# EAGLE schematic PowerSupply (EAGLE 6.5.0)
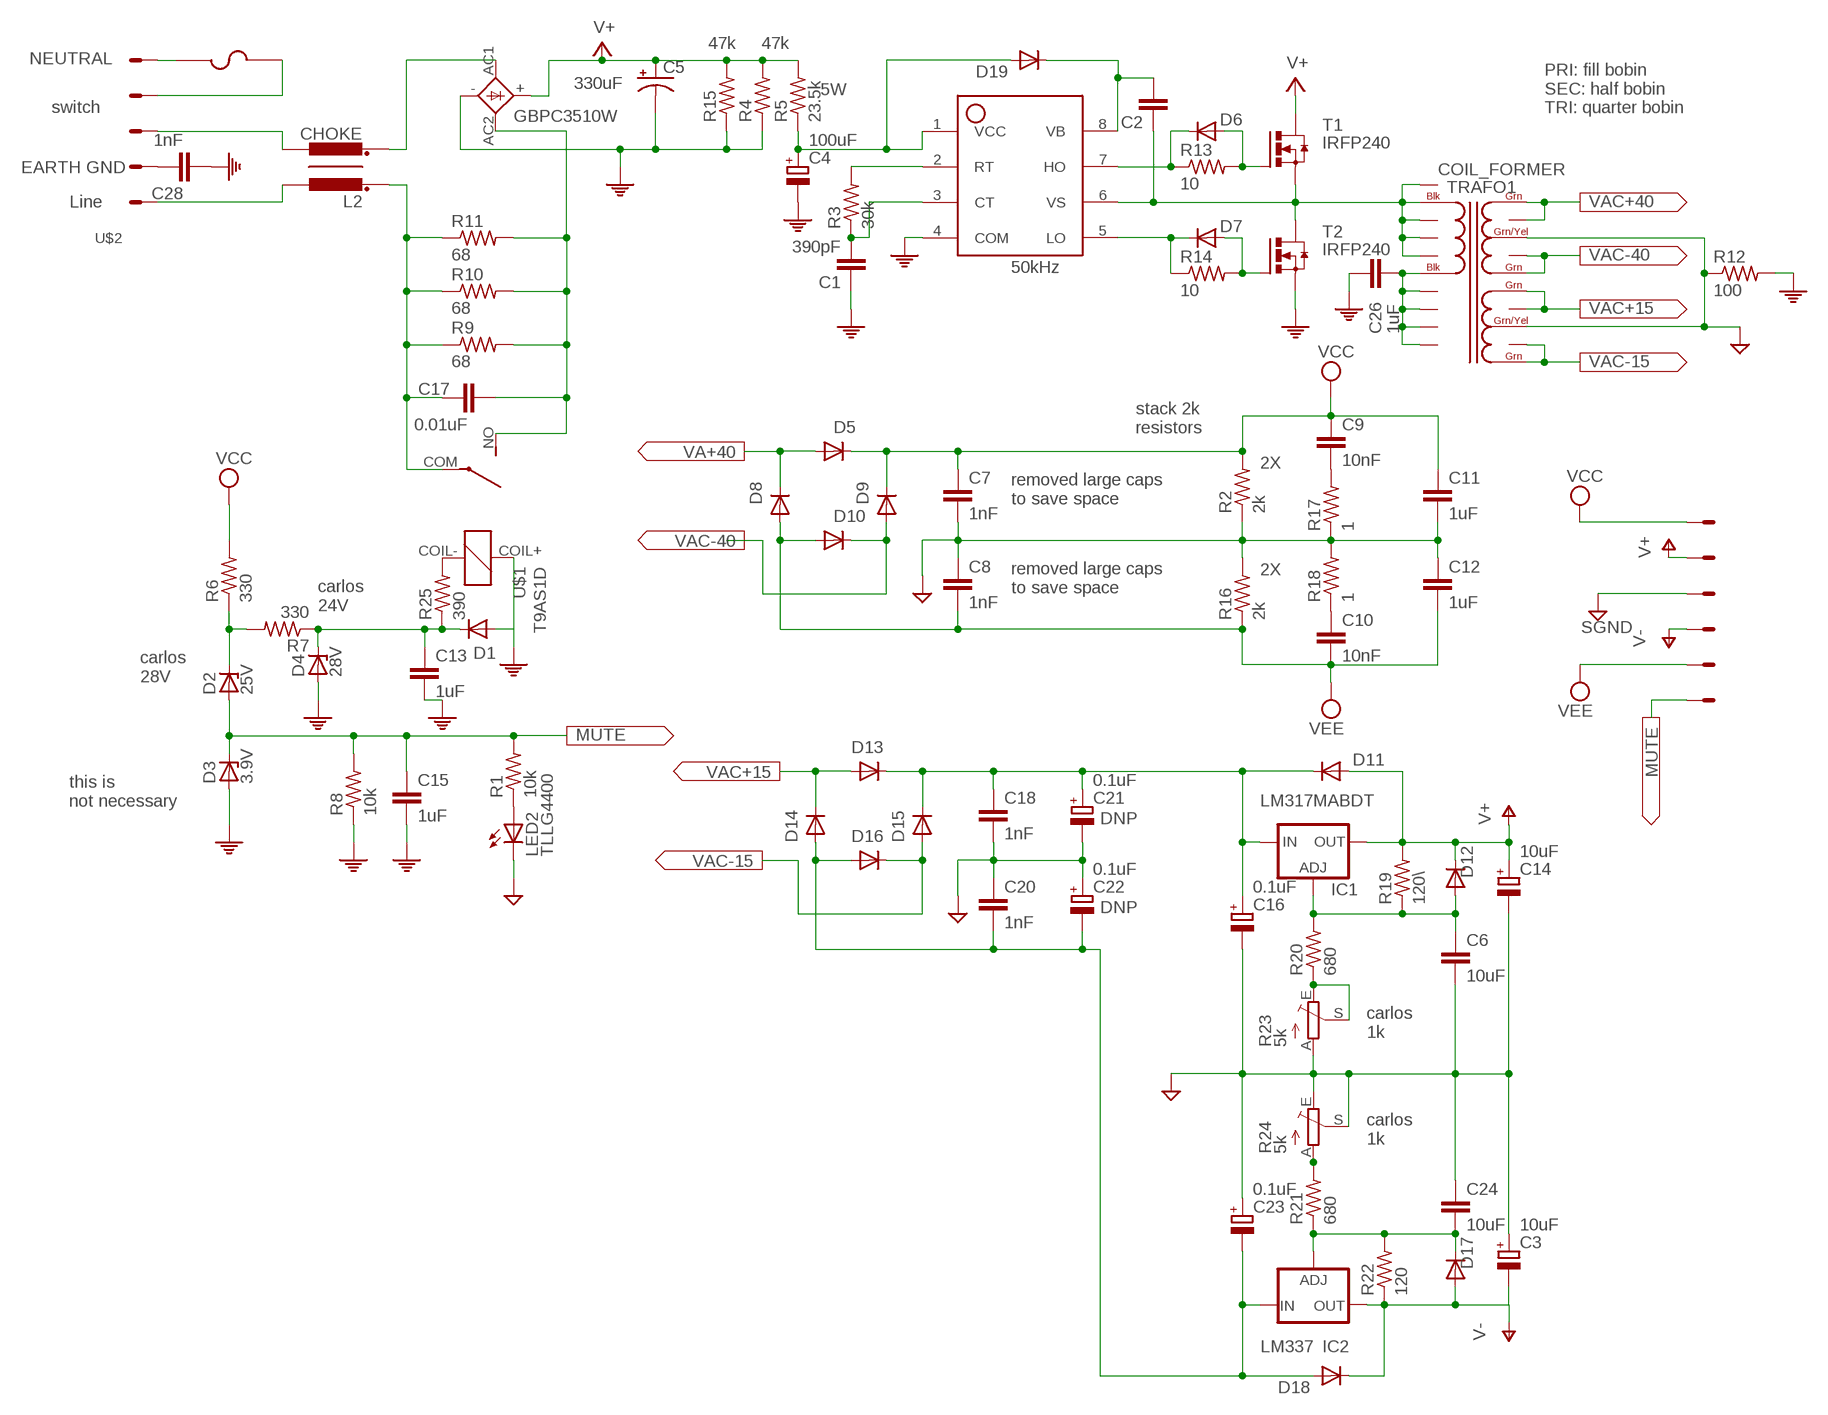
[diagram p0: schematic, sheet 1]

## Parts
C1  390pF  C-EU025-025X050  [C025-025X050]
C2  C-EU050-035X075  [C050-035X075]
C3  10uF  CPOL-EUE2.5-6  [E2,5-6]
C4  100uF  CPOL-EUE2.5-6  [E2,5-6]
C5  330uF  CPOL-USE7.5-18  [E7,5-18]
C6  10uF  C-EU025-025X050  [C025-025X050]
C7  1nF  C-EU102-064X133  [C102-064X133]
C8  1nF  C-EU102-064X133  [C102-064X133]
C9  10nF  C-EU102-064X133  [C102-064X133]
C10  10nF  C-EU102-064X133  [C102-064X133]
C11  1uF  C-EU102-064X133  [C102-064X133]
C12  1uF  C-EU102-064X133  [C102-064X133]
C13  1uF  C-EU102-064X133  [C102-064X133]
C14  10uF  CPOL-EUE2.5-6  [E2,5-6]
C15  1uF  C-EU102-064X133  [C102-064X133]
C16  0.1uF  CPOL-EUE2.5-6  [E2,5-6]
C17  0.01uF  C-EU075-042X103  [C075-042X103]
C18  1nF  C-EU102-064X133  [C102-064X133]
C20  1nF  C-EU102-064X133  [C102-064X133]
C21  0.1uF  CPOL-EUE2.5-6  [E2,5-6]
C22  0.1uF  CPOL-EUE2.5-6  [E2,5-6]
C23  0.1uF  CPOL-EUE2.5-6  [E2,5-6]
C24  10uF  C-EU025-025X050  [C025-025X050]
C26  1uF  C-EU025-025X050  [C025-025X050]
C28  1nF  C-EUC0805K  [C0805K]
D1  1N4004  [1N4004]
D2  25V  ZENER-DIODEP1-Z12  [P1Z12]
D3  3.9V  ZENER-DIODEZD-2.5  [ZDIO-2.5]
D4  28V  ZENER-DIODEP1-Z12  [P1Z12]
D5  VS-ETL1506-M3  [VS-ETL1506-M3]
D6  1N4004  [1N4004]
D7  1N4004  [1N4004]
D8  VS-ETL1506-M3  [VS-ETL1506-M3]
D9  VS-ETL1506-M3  [VS-ETL1506-M3]
D10  VS-ETL1506-M3  [VS-ETL1506-M3]
D11  1N4004  [1N4004]
D12  1N4004  [1N4004]
D13  1N4004  [1N4004]
D14  1N4004  [1N4004]
D15  1N4004  [1N4004]
D16  1N4004  [1N4004]
D17  1N4004  [1N4004]
D18  1N4004  [1N4004]
D19  1N4004  [1N4004]
IC1  LM317MABDT  [DPACK]
IC2  LM337  [LM337]
L2  CHOKE  [CHOKE]
LED2  TLLG4400  [LED3MM]
R1  10k  R-US_0204/2V  [0204V]
R2  2k  R-US_VTA52  [VTA52]
R3  30k  R-US_0204/2V  [0204V]
R4  47k  R-US_0617/5V  [0617V]
R5  23.5k  R-US_0617/5V  [0617V]
R6  330  R-US_0309/V  [0309V]
R7  330  R-US_0309/V  [0309V]
R8  10k  R-US_0204/2V  [0204V]
R9  68  R-US_0617/5V  [0617V]
R10  68  R-US_0617/5V  [0617V]
R11  68  R-US_0617/5V  [0617V]
R12  100  R-US_0207/15  [0207/15]
R13  10  R-US_0204/2V  [0204V]
R14  10  R-US_0204/2V  [0204V]
R15  47k  R-US_0617/5V  [0617V]
R16  2k  R-US_VTA52  [VTA52]
R17  1  R-US_0411/12  [0411/12]
R18  1  R-US_0411/12  [0411/12]
R19  120\  R-US_0204/2V  [0204V]
R20  680  R-US_0204/2V  [0204V]
R21  680  R-US_0204/2V  [0204V]
R22  120  R-US_0204/2V  [0204V]
R23  5k  TRIM_EU-B25P  [B25P]
R24  5k  TRIM_EU-B25P  [B25P]
R25  390  R-US_0204/2V  [0204V]
T1  IRFP240  [IRFP240]
T2  IRFP240  [IRFP240]
TRAFO1  COIL_FORMER  [COIL_FORMER]
U$1  T9AS1D  [RELAY_CM]
U$2  SCREW_TERMINAL_5  [SCREW_TERMINAL_5]
U$3  SCREW_TERMINAL_6  [SCREW_TERMINAL_6]
U$4  FUSE  [FUSE_PADS]
U$5  IRS2153D  [IRS2153D]
U$6  GBPC3510W  [GBPC3510W]

## Nets
EGND: C28.1 U$2.P$3(S2)
GND: C1.1 C4.- C5.- C13.2 C15.2 C26.1 C28.2 D1.A D3.A D4.A R4.1 R8.1 R12.2 R15.1 T2.S U$1.COIL+ U$5.4(COM) U$6.- ; supply symbol labelled PE
LINE: L2.PASS12 U$2.P$2(S1)
MUTE: C15.1 D2.A D3.C R1.2 R8.2 U$3.P$6(S6)
N$1: LED2.A R1.1
N$3: C24.2 D17.C IC2.1(ADJ) R21.1 R22.2
N$4: L2.PASS2 U$6.AC1
N$6: C2.2 D19.C U$5.8(VB)
N$7: C1.2 R3.1 U$5.3(CT)
N$8: C9.2 R17.2
N$9: C26.2 TRAFO1.P$6(P2) TRAFO1.P$7(P22) TRAFO1.P$8(P23) TRAFO1.P$9(P24) TRAFO1.P$10(P25)
N$10: R25.2 U$1.COIL-
N$11: D2.C R6.1 R7.2
N$13: R3.2 U$5.2(RT)
N$14: D6.C R13.1 U$5.7(HO)
N$15: R20.1 R23.E R23.S
N$16: C13.1 D1.C D4.C R7.1 R25.1
N$17: C4.+ D19.A R5.1 U$5.1(VCC)
N$18: C17.2 R9.2 R10.2 R11.2 U$1.NO U$6.AC2
N$19: D6.A R13.2 T1.G
N$20: D7.C R14.1 U$5.5(LO)
N$21: D7.A R14.2 T2.G
N$22: C2.1 T1.S T2.D TRAFO1.P$1(P1) TRAFO1.P$2(P12) TRAFO1.P$3(P13) TRAFO1.P$4(P14) TRAFO1.P$5(P15) U$5.6(VS)
N$23: R21.2 R24.A
N$25: C10.1 R18.1
N$26: C6.1 D12.A IC1.1(ADJ) R19.1 R20.2
NUTRAL: U$2.P$6(S5) U$4.P$1 U$4.P$3
SGND: C3.+ C6.2 C7.2 C8.1 C11.2 C12.1 C14.- C16.- C18.2 C20.1 C21.- C22.+ C23.+ C24.1 LED2.K(C) R2.1 R12.1 R16.2 R17.1 R18.2 R23.A R24.E R24.S TRAFO1.P$13(GND30) TRAFO1.P$18(GND15) U$3.P$3(S3)
SOMENET: C17.1 L2.PASS1 R9.1 R10.1 R11.1 U$1.COM
SWITCH1: U$2.P$5(S4) U$4.P$2 U$4.P$4
SWITCH2: L2.PASS22 U$2.P$4(S3)
V15+: C14.+ D11.A D12.C IC1.4(OUT) R19.2 U$3.P$2(S2) ; supply symbol labelled V+
V15-: C3.- D17.A D18.C IC2.3(OUT) R22.1 U$3.P$4(S4) ; supply symbol labelled V-
V15UN: C16.+ C18.1 C21.+ D11.C D13.C D15.C IC1.3(IN)
V+: C5.+ R4.2 R5.2 R15.2 T1.D U$6.+
V-15UN: C20.2 C22.- C23.- D14.A D16.A D18.A IC2.4(IN)
VAC+15: D13.A D14.C TRAFO1.P$16(SEC15+) TRAFO1.P$17(S15+1)
VAC+40: D5.A D8.C TRAFO1.P$11(SEC30V+) TRAFO1.P$12(S30+1)
VAC-15: D15.A D16.C TRAFO1.P$19(S15-1) TRAFO1.P$20(SEC15-)
VAC-40: D9.A D10.C TRAFO1.P$14(S30-1) TRAFO1.P$15(SEC30-)
VCC: C7.1 C9.1 C11.1 D5.C D9.C R2.2 R6.2 U$3.P$1(S1)
VEE: C8.2 C10.2 C12.2 D8.A D10.A R16.1 U$3.P$5(S5)
Unconnected: D5.NOC1 D5.NOC2 D8.NOC1 D8.NOC2 D9.NOC1 D9.NOC2 D10.NOC1 D10.NOC2 T1.P$3 T1.P$4 T2.P$3 T2.P$4

## Notes on the sheet
- NEUTRAL
- 5W
- switch
- PRI: fill bobin
  SEC: half bobin
  TRI: quarter bobin
- EARTH GND
- Line
- 50kHz
- stack 2k
  resistors
- 2X
- removed large caps 
  to save space
- 2X
- removed large caps 
  to save space
- carlos
  24V
- carlos
  28V
- this is
  not necessary
- DNP
- DNP
- carlos 
  1k
- carlos 
  1k

## Library data of the parts
C1 C6 C24 C26 = resistor:C-EU: CAPACITOR, European symbol
C2 C7-C13 C15 C17 C18 C20 C28 = rcl:C-EU: CAPACITOR, European symbol
C3 C4 C14 C16 C21-C23 = rcl:CPOL-EU: POLARIZED CAPACITOR, European symbol
C5 = rcl:CPOL-US: POLARIZED CAPACITOR, American symbol
D1 D6 D7 D11-D19 = Amplifier_Parts:1N4004
D2-D4 = diode:ZENER-DIODE: Z-Diode
D5 D8-D10 = Amplifier_Parts:VS-ETL1506-M3
IC1 = v-reg:LM317?*: 500 mA Adjustable Output Positive Voltage Regulator Source: http://www.onsemi.co.jp .. LM317M-D.PDF
IC2 = Amplifier_Parts:LM337
L2 = Amplifier_Parts:CHOKE
LED2 = led:TLLG4400: Low Current (2mA) LED 3 mm Tinted Diffused Package color GREEN Source: Data sheet <http://www.farnell.com/datasheets/391098.pdf>; MF: VISHAY SEMICONDUCTOR; OC_FARNELL: 1612435
R1-R11 R15-R22 R25 = rcl:R-US_: RESISTOR, American symbol
R12-R14 = resistor:R-US_: RESISTOR, American symbol
R23 R24 = pot:TRIM_EU-: POTENTIOMETER
T1 T2 = Amplifier_Parts:IRFP240
TRAFO1 = Amplifier_Parts:COIL_FORMER
U$1 = Amplifier_Parts:T9AS1D
U$2 = Amplifier_Parts:SCREW_TERMINAL_5
U$3 = Amplifier_Parts:SCREW_TERMINAL_6
U$4 = Amplifier_Parts:FUSE
U$5 = Amplifier_Parts:IRS2153D
U$6 = Amplifier_Parts:GBPC3510W